# Altium schematic sheet EE52_Digital_Oscilloscope.SchDoc
size D
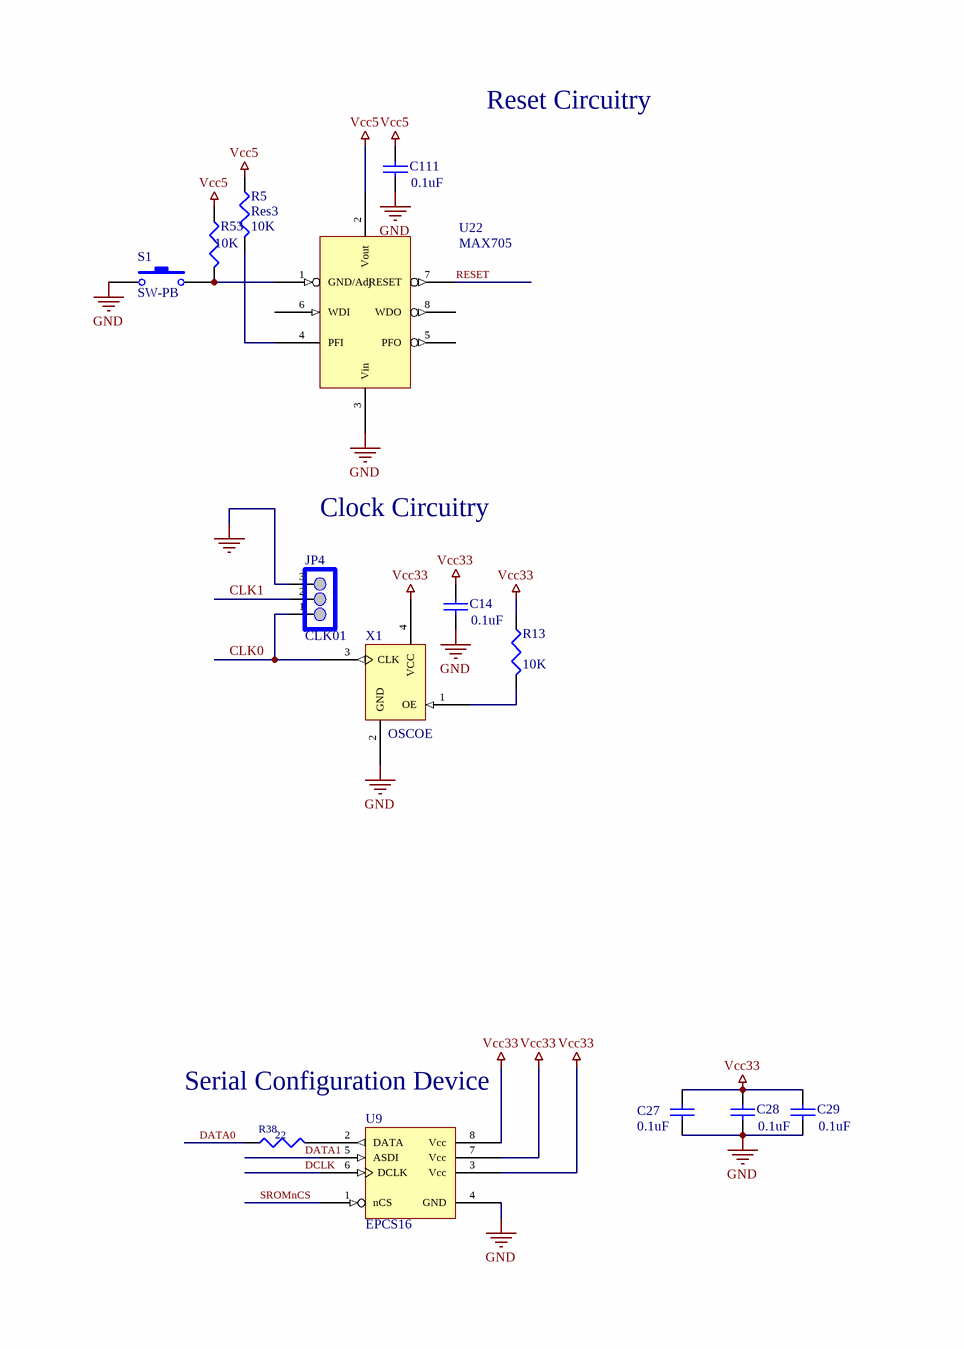
[diagram p0: EE52_Digital_Oscilloscope.SchDoc, top left]
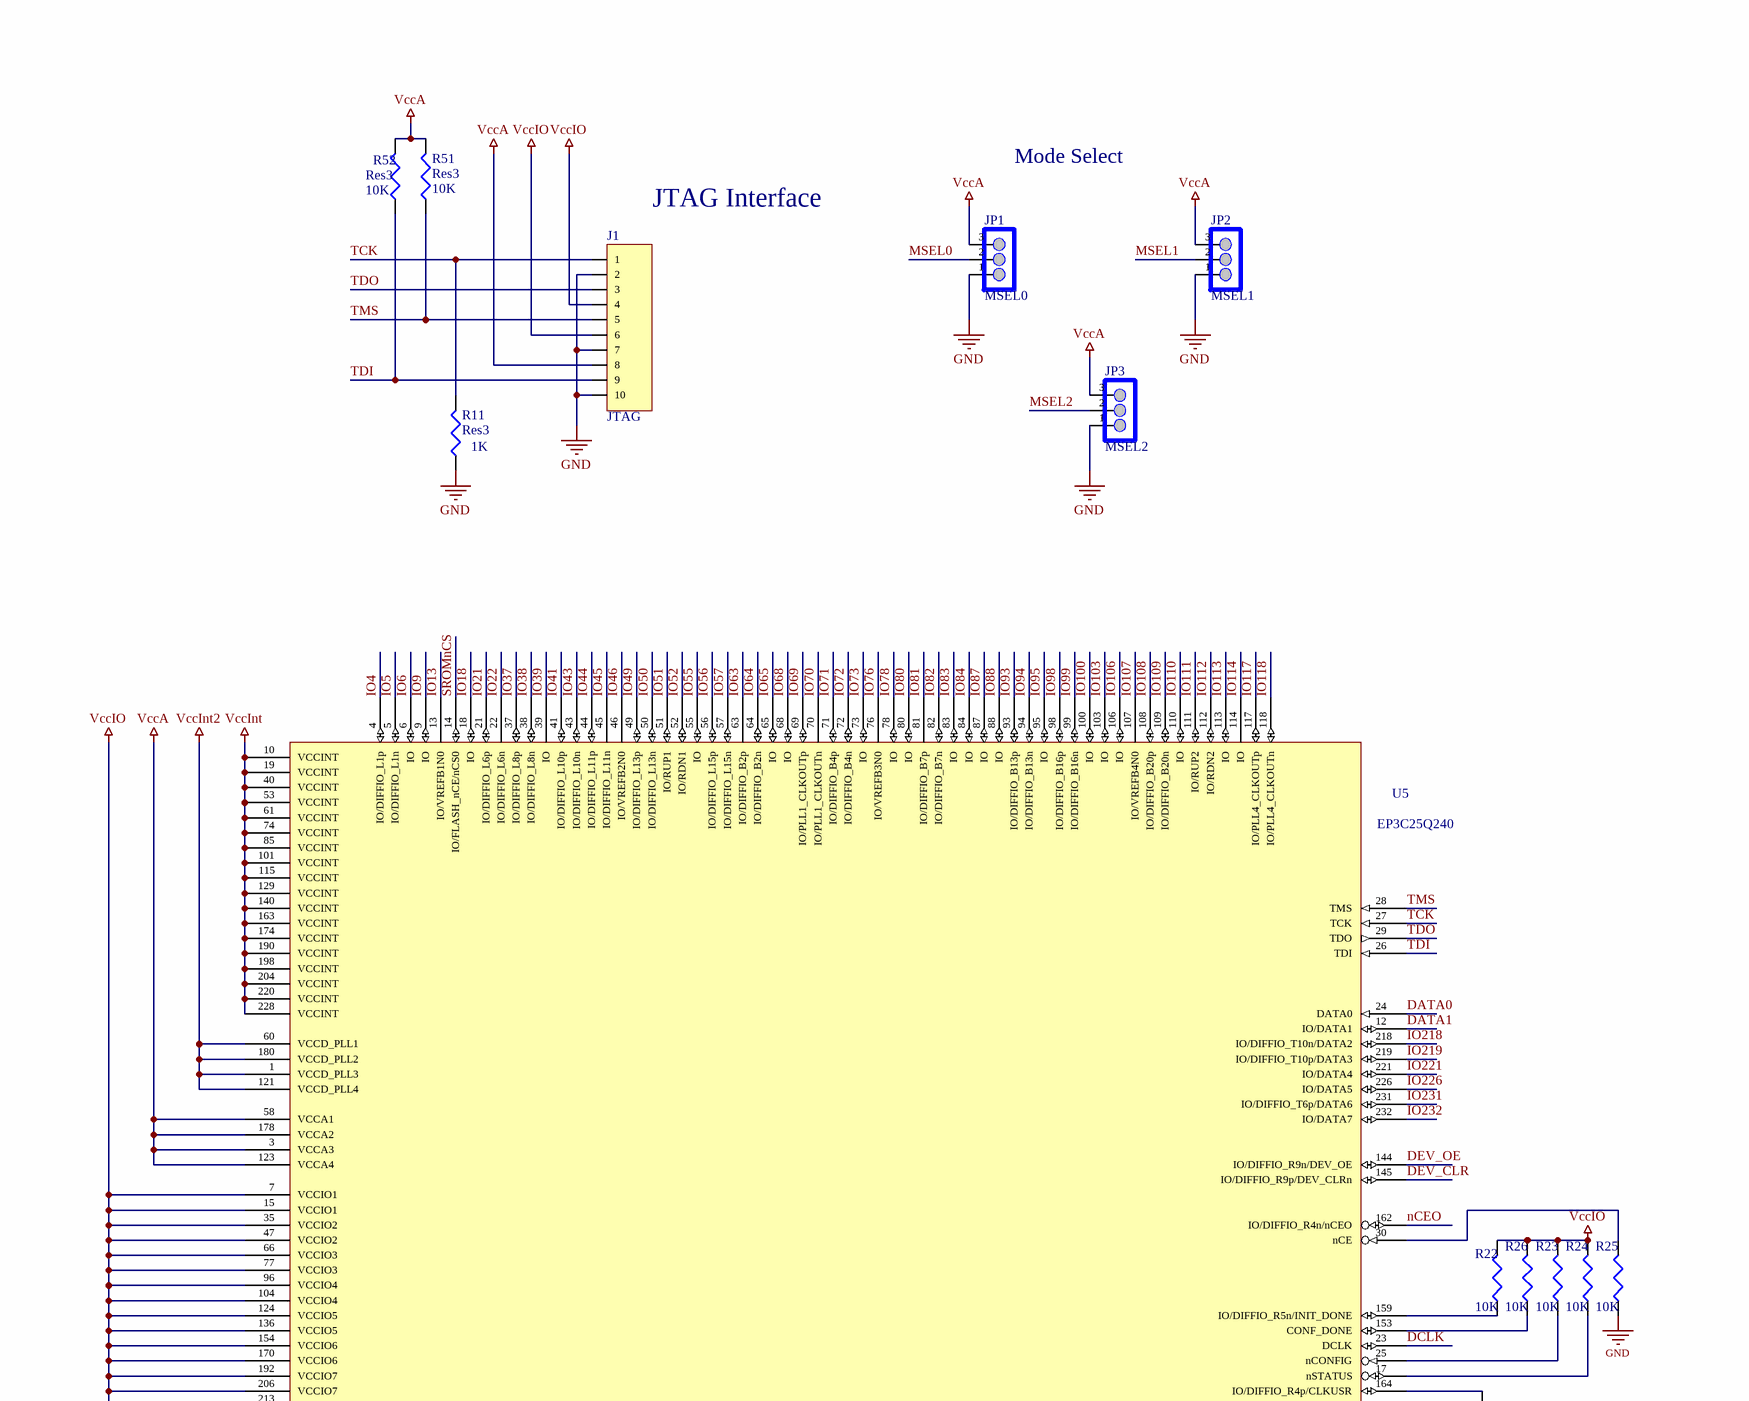
[diagram p1: EE52_Digital_Oscilloscope.SchDoc, top middle]
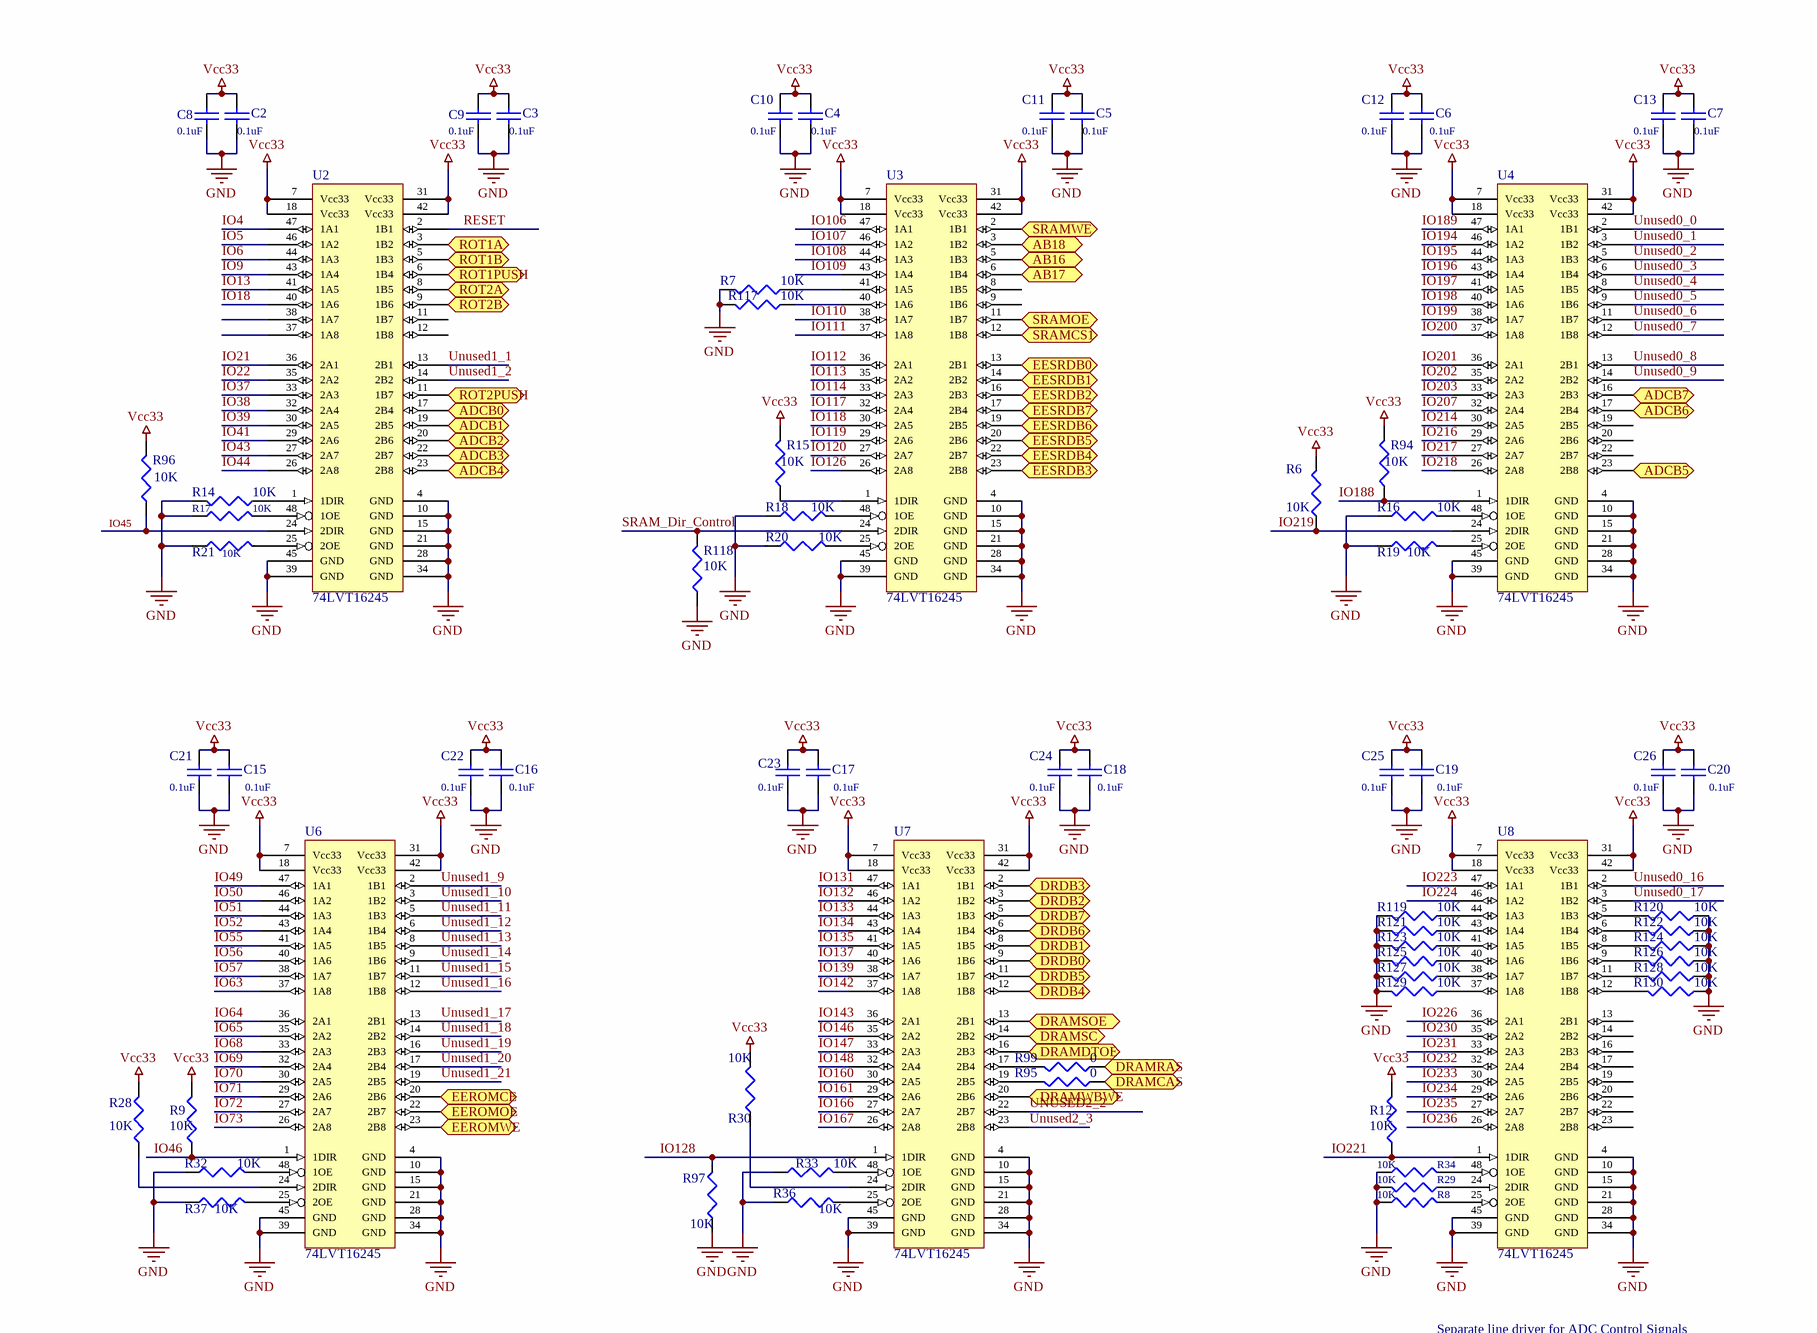
[diagram p2: EE52_Digital_Oscilloscope.SchDoc, top right]
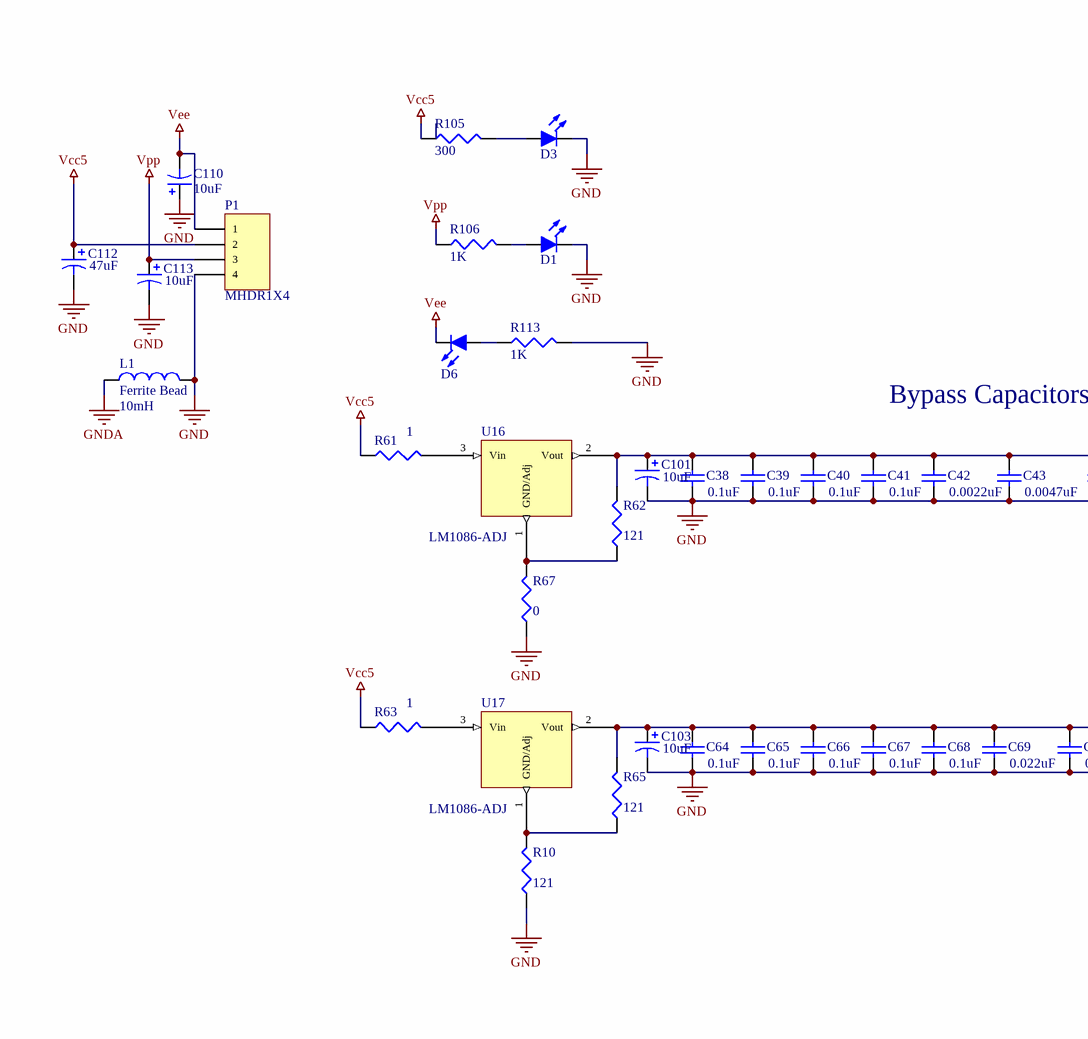
[diagram p3: EE52_Digital_Oscilloscope.SchDoc, bottom left]
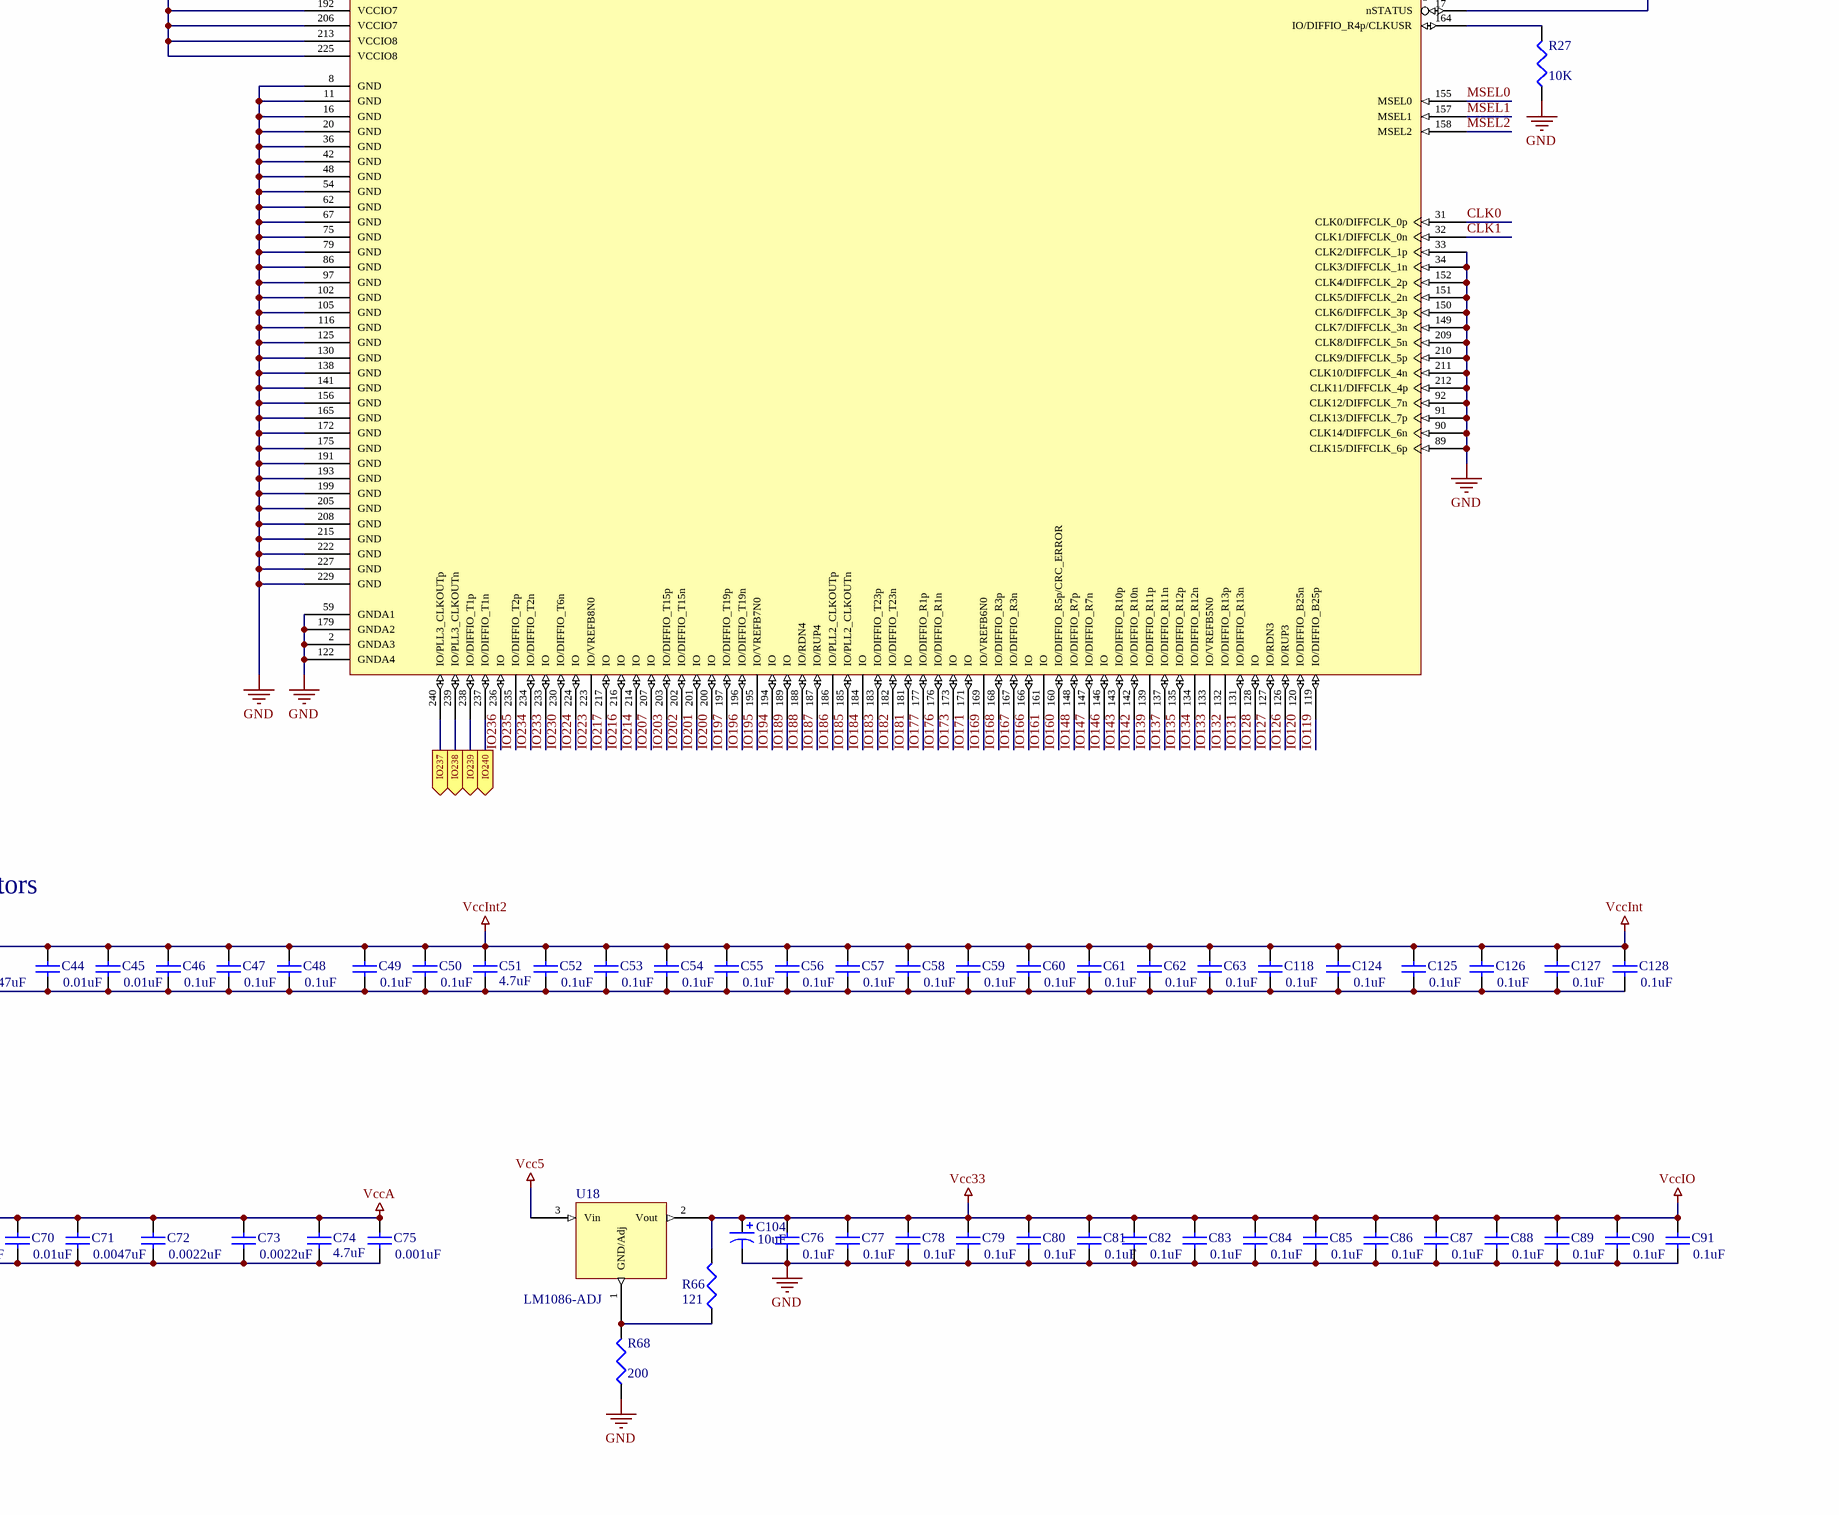
[diagram p4: EE52_Digital_Oscilloscope.SchDoc, bottom middle]
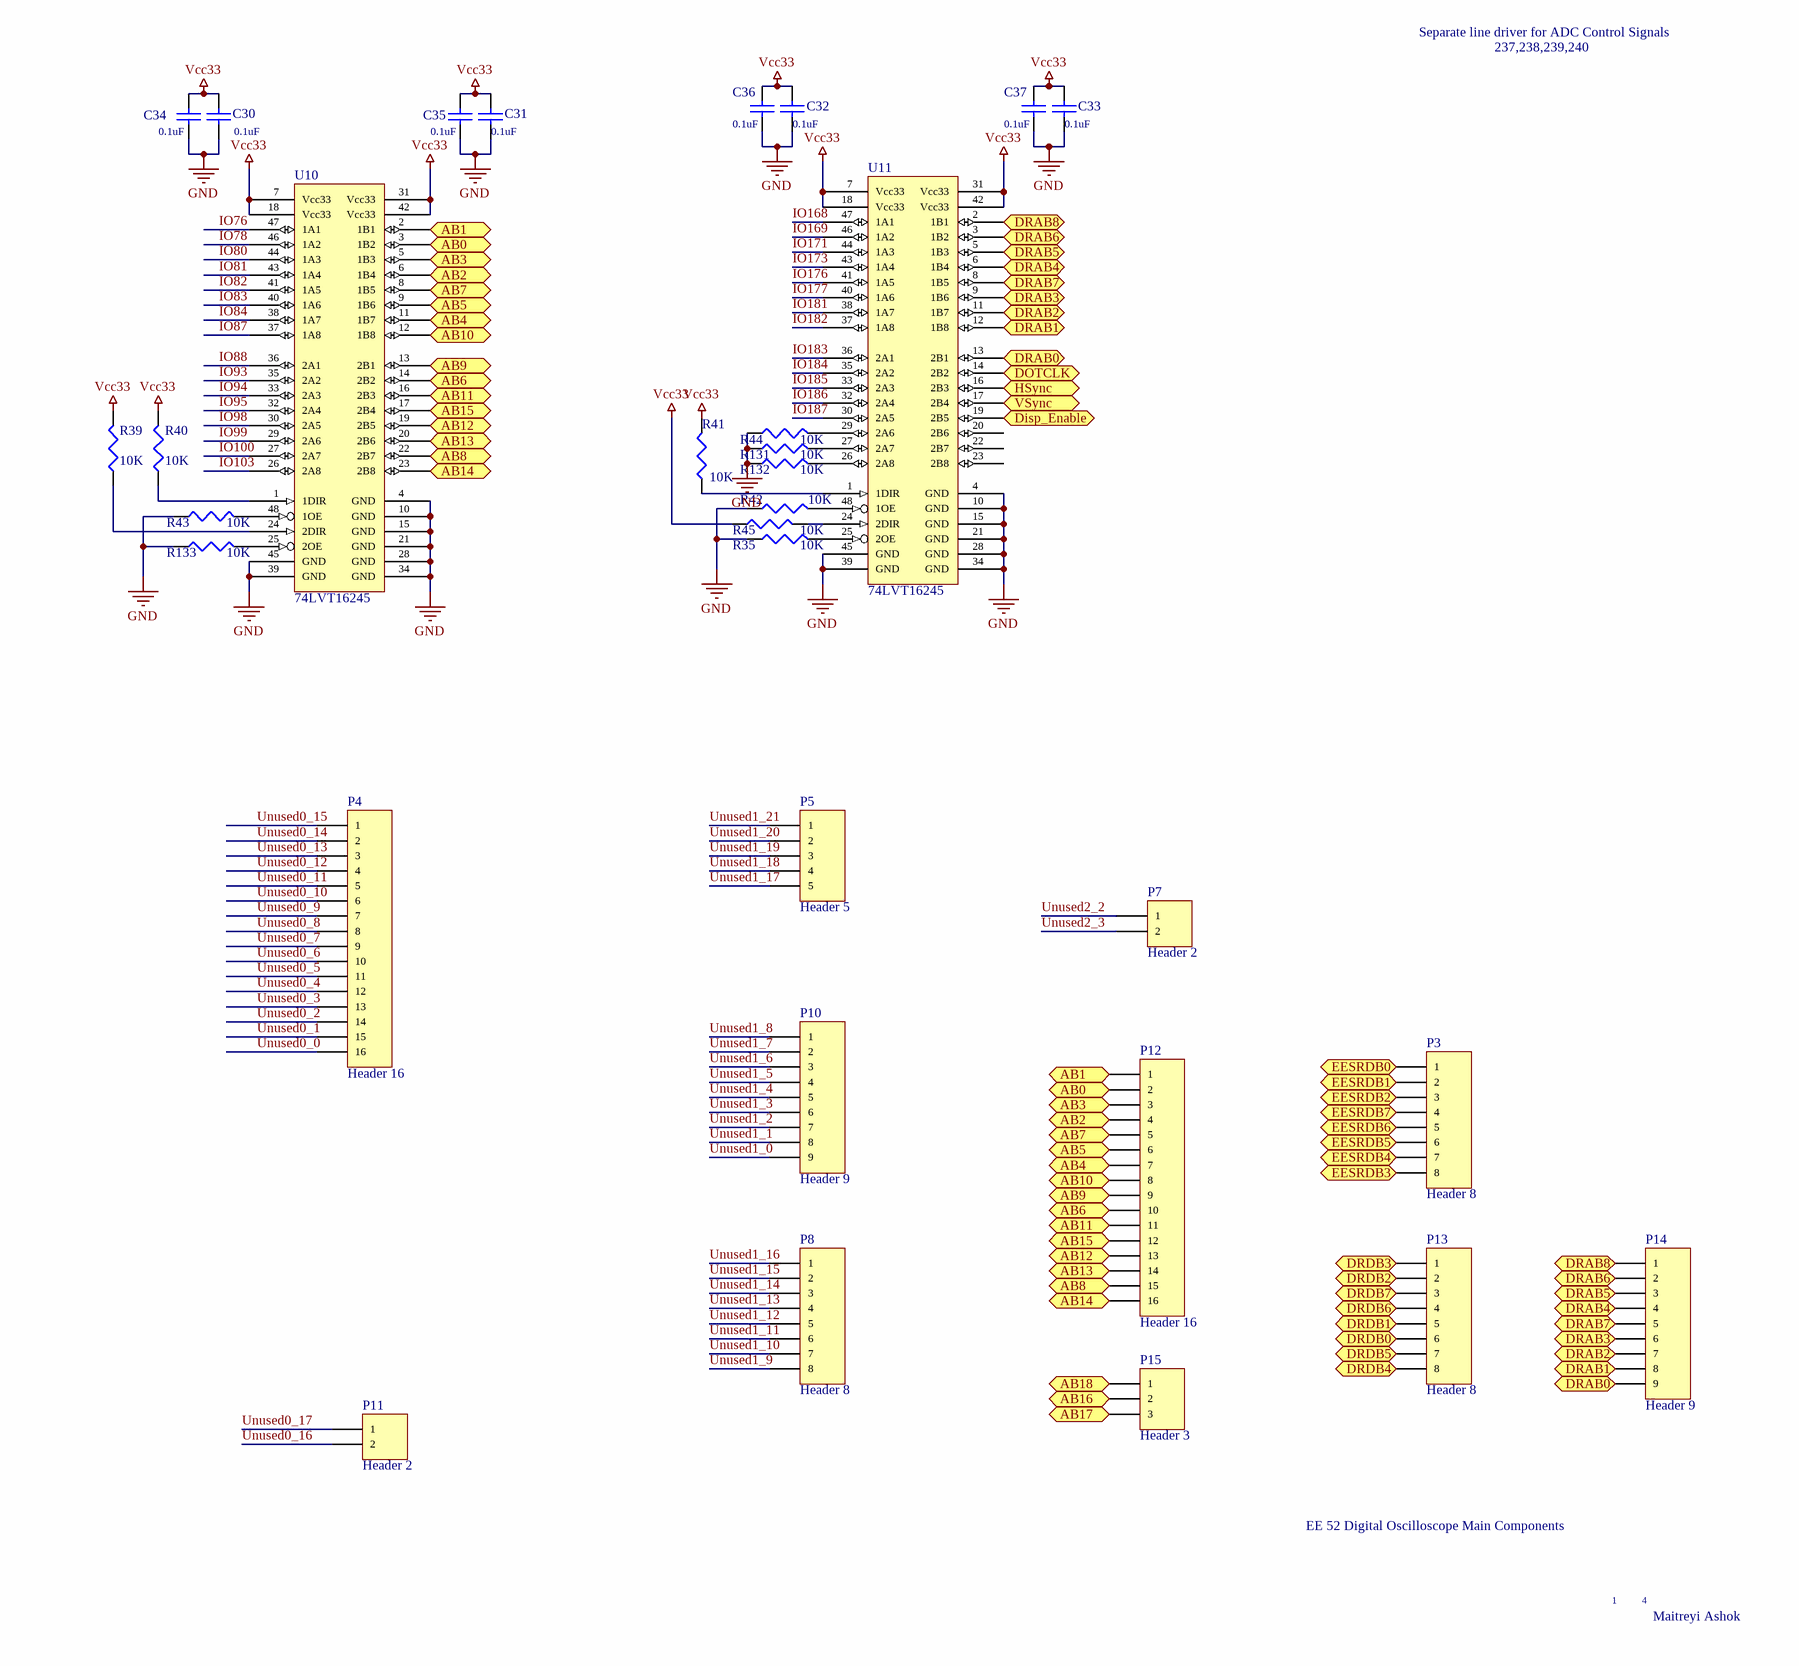
[diagram p5: EE52_Digital_Oscilloscope.SchDoc, bottom right]

## Parts
C2  value 0.1uF  [1608[0603]]  (hidden comment: Cap)
C3  value 0.1uF  [1608[0603]]  (hidden comment: Cap)
C4  value 0.1uF  [1608[0603]]  (hidden comment: Cap)
C5  value 0.1uF  [1608[0603]]  (hidden comment: Cap)
C6  value 0.1uF  [1608[0603]]  (hidden comment: Cap)
C7  value 0.1uF  [1608[0603]]  (hidden comment: Cap)
C8  value 0.1uF  [1608[0603]]  (hidden comment: Cap)
C9  value 0.1uF  [1608[0603]]  (hidden comment: Cap)
C10  value 0.1uF  [1608[0603]]  (hidden comment: Cap)
C11  value 0.1uF  [1608[0603]]  (hidden comment: Cap)
C12  value 0.1uF  [1608[0603]]  (hidden comment: Cap)
C13  value 0.1uF  [1608[0603]]  (hidden comment: Cap)
C14  value 0.1uF  [1608[0603]]  (hidden comment: Cap)
C15  value 0.1uF  [1608[0603]]  (hidden comment: Cap)
C16  value 0.1uF  [1608[0603]]  (hidden comment: Cap)
C17  value 0.1uF  [1608[0603]]  (hidden comment: Cap)
C18  value 0.1uF  [1608[0603]]  (hidden comment: Cap)
C19  value 0.1uF  [1608[0603]]  (hidden comment: Cap)
C20  value 0.1uF  [1608[0603]]  (hidden comment: Cap)
C21  value 0.1uF  [1608[0603]]  (hidden comment: Cap)
C22  value 0.1uF  [1608[0603]]  (hidden comment: Cap)
C23  value 0.1uF  [1608[0603]]  (hidden comment: Cap)
C24  value 0.1uF  [1608[0603]]  (hidden comment: Cap)
C25  value 0.1uF  [1608[0603]]  (hidden comment: Cap)
C26  value 0.1uF  [1608[0603]]  (hidden comment: Cap)
C27  value 0.1uF  [1608[0603]]  (hidden comment: Cap)
C28  value 0.1uF  [1608[0603]]  (hidden comment: Cap)
C29  value 0.1uF  [1608[0603]]  (hidden comment: Cap)
C30  value 0.1uF  [1608[0603]]  (hidden comment: Cap)
C31  value 0.1uF  [1608[0603]]  (hidden comment: Cap)
C32  value 0.1uF  [1608[0603]]  (hidden comment: Cap)
C33  value 0.1uF  [1608[0603]]  (hidden comment: Cap)
C34  value 0.1uF  [1608[0603]]  (hidden comment: Cap)
C35  value 0.1uF  [1608[0603]]  (hidden comment: Cap)
C36  value 0.1uF  [1608[0603]]  (hidden comment: Cap)
C37  value 0.1uF  [1608[0603]]  (hidden comment: Cap)
C38  value 0.1uF  [1608[0603]]  (hidden comment: Cap)
C39  value 0.1uF  [1608[0603]]  (hidden comment: Cap)
C40  value 0.1uF  [1608[0603]]  (hidden comment: Cap)
C41  value 0.1uF  [1608[0603]]  (hidden comment: Cap)
C42  value 0.0022uF  [1608[0603]]  (hidden comment: Cap)
C43  value 0.0047uF  [1608[0603]]  (hidden comment: Cap)
C44  value 0.01uF  [1608[0603]]  (hidden comment: Cap)
C45  value 0.01uF  [1608[0603]]  (hidden comment: Cap)
C46  value 0.1uF  [1608[0603]]  (hidden comment: Cap)
C47  value 0.1uF  [1608[0603]]  (hidden comment: Cap)
C48  value 0.1uF  [1608[0603]]  (hidden comment: Cap)
C49  value 0.1uF  [1608[0603]]  (hidden comment: Cap)
C50  value 0.1uF  [1608[0603]]  (hidden comment: Cap)
C51  value 4.7uF  [RB.1/.2]  (hidden comment: Cap)
C52  value 0.1uF  [1608[0603]]  (hidden comment: Cap)
C53  value 0.1uF  [1608[0603]]  (hidden comment: Cap)
C54  value 0.1uF  [1608[0603]]  (hidden comment: Cap)
C55  value 0.1uF  [1608[0603]]  (hidden comment: Cap)
C56  value 0.1uF  [1608[0603]]  (hidden comment: Cap)
C57  value 0.1uF  [1608[0603]]  (hidden comment: Cap)
C58  value 0.1uF  [1608[0603]]  (hidden comment: Cap)
C59  value 0.1uF  [1608[0603]]  (hidden comment: Cap)
C60  value 0.1uF  [1608[0603]]  (hidden comment: Cap)
C61  value 0.1uF  [1608[0603]]  (hidden comment: Cap)
C62  value 0.1uF  [1608[0603]]  (hidden comment: Cap)
C63  value 0.1uF  [1608[0603]]  (hidden comment: Cap)
C64  value 0.1uF  [1608[0603]]  (hidden comment: Cap)
C65  value 0.1uF  [1608[0603]]  (hidden comment: Cap)
C66  value 0.1uF  [1608[0603]]  (hidden comment: Cap)
C67  value 0.1uF  [1608[0603]]  (hidden comment: Cap)
C68  value 0.1uF  [1608[0603]]  (hidden comment: Cap)
C69  value 0.022uF  [1608[0603]]  (hidden comment: Cap)
C70  value 0.01uF  [1608[0603]]  (hidden comment: Cap)
C71  value 0.0047uF  [1608[0603]]  (hidden comment: Cap)
C72  value 0.0022uF  [1608[0603]]  (hidden comment: Cap)
C73  value 0.0022uF  [1608[0603]]  (hidden comment: Cap)
C74  value 4.7uF  [RB.1/.2]  (hidden comment: Cap)
C75  value 0.001uF  [1608[0603]]  (hidden comment: Cap)
C76  value 0.1uF  [1608[0603]]  (hidden comment: Cap)
C77  value 0.1uF  [1608[0603]]  (hidden comment: Cap)
C78  value 0.1uF  [1608[0603]]  (hidden comment: Cap)
C79  value 0.1uF  [1608[0603]]  (hidden comment: Cap)
C80  value 0.1uF  [1608[0603]]  (hidden comment: Cap)
C81  value 0.1uF  [1608[0603]]  (hidden comment: Cap)
C82  value 0.1uF  [1608[0603]]  (hidden comment: Cap)
C83  value 0.1uF  [1608[0603]]  (hidden comment: Cap)
C84  value 0.1uF  [1608[0603]]  (hidden comment: Cap)
C85  value 0.1uF  [1608[0603]]  (hidden comment: Cap)
C86  value 0.1uF  [1608[0603]]  (hidden comment: Cap)
C87  value 0.1uF  [1608[0603]]  (hidden comment: Cap)
C88  value 0.1uF  [1608[0603]]  (hidden comment: Cap)
C89  value 0.1uF  [1608[0603]]  (hidden comment: Cap)
C90  value 0.1uF  [1608[0603]]  (hidden comment: Cap)
C91  value 0.1uF  [1608[0603]]  (hidden comment: Cap)
C101  value 10uF  [RB.1/.2]  (hidden comment: Cap Pol1)
C103  value 10uF  [RB.1/.2]  (hidden comment: Cap Pol1)
C104  value 10uF  [RB.1/.2]  (hidden comment: Cap Pol1)
C110  value 10uF  [RB.1/.2]  (hidden comment: Cap Pol1)
C111  value 0.1uF  [1608[0603]]  (hidden comment: Cap)
C112  value 47uF  [RB.1/.2]  (hidden comment: Cap Pol1)
C113  value 10uF  [RB.1/.2]  (hidden comment: Cap Pol1)
C118  value 0.1uF  [1608[0603]]  (hidden comment: Cap)
C124  value 0.1uF  [1608[0603]]  (hidden comment: Cap)
C125  value 0.1uF  [1608[0603]]  (hidden comment: Cap)
C126  value 0.1uF  [1608[0603]]  (hidden comment: Cap)
C127  value 0.1uF  [1608[0603]]  (hidden comment: Cap)
C128  value 0.1uF  [1608[0603]]  (hidden comment: Cap)
D1  LED  [LED-T13/4]  (value not drawn)
D3  LED  [LED-T13/4]  (value not drawn)
D6  LED  [LED-T13/4]  (value not drawn)
J1  JTAG  [HDR2X5]
JP1  MSEL0  [HDR1X3]
JP2  MSEL1  [HDR1X3]
JP3  MSEL2  [HDR1X3]
JP4  CLK01  [HDR1X3]
L1  Ferrite Bead  value 10mH  [FerriteBead]
P1  MHDR1X4  [MDIN4]
P3  Header 8  [HDR1X8]
P4  Header 16  [HDR1X16]
P5  Header 5  [HDR1X5]
P7  Header 2  [HDR1X2]
P8  Header 8  [HDR1X8]
P10  Header 9  [HDR1X9]
P11  Header 2  [HDR1X2]
P12  Header 16  [HDR1X16]
P13  Header 8  [HDR1X8]
P14  Header 9  [HDR1X9]
P15  Header 3  [HDR1X3]
R5  Res3  value 10K  [J1-0603]
R6  value 10K  [J1-0603]  (hidden comment: Res3)
R7  value 10K  [J1-0603]  (hidden comment: Res3)
R8  value 10K  [J1-0603]  (hidden comment: Res3)
R9  value 10K  [J1-0603]  (hidden comment: Res3)
R10  value 121  [J1-0603]  (hidden comment: Res3)
R11  Res3  value 1K  [J1-0603]
R12  value 10K  [J1-0603]  (hidden comment: Res3)
R13  value 10K  [J1-0603]  (hidden comment: Res3)
R14  value 10K  [J1-0603]  (hidden comment: Res3)
R15  value 10K  [J1-0603]  (hidden comment: Res3)
R16  value 10K  [J1-0603]  (hidden comment: Res3)
R17  value 10K  [J1-0603]  (hidden comment: Res3)
R18  value 10K  [J1-0603]  (hidden comment: Res3)
R19  value 10K  [J1-0603]  (hidden comment: Res3)
R20  value 10K  [J1-0603]  (hidden comment: Res3)
R21  value 10K  [J1-0603]  (hidden comment: Res3)
R22  value 10K  [J1-0603]  (hidden comment: Res3)
R23  value 10K  [J1-0603]  (hidden comment: Res3)
R24  value 10K  [J1-0603]  (hidden comment: Res3)
R25  value 10K  [J1-0603]  (hidden comment: Res3)
R26  value 10K  [J1-0603]  (hidden comment: Res3)
R27  value 10K  [J1-0603]  (hidden comment: Res3)
R28  value 10K  [J1-0603]  (hidden comment: Res3)
R29  value 10K  [J1-0603]  (hidden comment: Res3)
R30  value 10K  [J1-0603]  (hidden comment: Res3)
R32  value 10K  [J1-0603]  (hidden comment: Res3)
R33  value 10K  [J1-0603]  (hidden comment: Res3)
R34  value 10K  [J1-0603]  (hidden comment: Res3)
R35  value 10K  [J1-0603]  (hidden comment: Res3)
R36  value 10K  [J1-0603]  (hidden comment: Res3)
R37  value 10K  [J1-0603]  (hidden comment: Res3)
R38  value 22  [J1-0603]  (hidden comment: Res3)
R39  value 10K  [J1-0603]  (hidden comment: Res3)
R40  value 10K  [J1-0603]  (hidden comment: Res3)
R41  value 10K  [J1-0603]  (hidden comment: Res3)
R42  value 10K  [J1-0603]  (hidden comment: Res3)
R43  value 10K  [J1-0603]  (hidden comment: Res3)
R44  value 10K  [J1-0603]  (hidden comment: Res3)
R45  value 10K  [J1-0603]  (hidden comment: Res3)
R51  Res3  value 10K  [J1-0603]
R52  Res3  value 10K  [J1-0603]
R53  value 10K  [J1-0603]  (hidden comment: Res3)
R61  value 1  [AXIAL-0.7]  (hidden comment: Res3)
R62  value 121  [J1-0603]  (hidden comment: Res3)
R63  value 1  [AXIAL-0.7]  (hidden comment: Res3)
R65  value 121  [J1-0603]  (hidden comment: Res3)
R66  value 121  [J1-0603]  (hidden comment: Res3)
R67  value 0  [J1-0603]  (hidden comment: Res3)
R68  value 200  [J1-0603]  (hidden comment: Res3)
R94  value 10K  [J1-0603]  (hidden comment: Res3)
R95  value 0  [J1-0603]  (hidden comment: Res3)
R96  value 10K  [J1-0603]  (hidden comment: Res3)
R97  value 10K  [J1-0603]  (hidden comment: Res3)
R99  value 0  [J1-0603]  (hidden comment: Res3)
R105  value 300  [J1-0603]  (hidden comment: Res3)
R106  value 1K  [J1-0603]  (hidden comment: Res3)
R113  value 1K  [J1-0603]  (hidden comment: Res3)
R117  value 10K  [J1-0603]  (hidden comment: Res3)
R118  value 10K  [J1-0603]  (hidden comment: Res3)
R119  value 10K  [J1-0603]  (hidden comment: Res3)
R120  value 10K  [J1-0603]  (hidden comment: Res3)
R121  value 10K  [J1-0603]  (hidden comment: Res3)
R122  value 10K  [J1-0603]  (hidden comment: Res3)
R123  value 10K  [J1-0603]  (hidden comment: Res3)
R124  value 10K  [J1-0603]  (hidden comment: Res3)
R125  value 10K  [J1-0603]  (hidden comment: Res3)
R126  value 10K  [J1-0603]  (hidden comment: Res3)
R127  value 10K  [J1-0603]  (hidden comment: Res3)
R128  value 10K  [J1-0603]  (hidden comment: Res3)
R129  value 10K  [J1-0603]  (hidden comment: Res3)
R130  value 10K  [J1-0603]  (hidden comment: Res3)
R131  value 10K  [J1-0603]  (hidden comment: Res3)
R132  value 10K  [J1-0603]  (hidden comment: Res3)
R133  value 10K  [J1-0603]  (hidden comment: Res3)
S1  SW-PB  [EG140X]
U2  74LVT16245  [TSSOP48]
U3  74LVT16245  [TSSOP48]
U4  74LVT16245  [TSSOP48]
U5  EP3C25Q240  [PQFP240]
U6  74LVT16245  [TSSOP48]
U7  74LVT16245  [TSSOP48]
U8  74LVT16245  [TSSOP48]
U9  EPCS16  [SO-8]
U10  74LVT16245  [TSSOP48]
U11  74LVT16245  [TSSOP48]
U16  LM1086-ADJ  [TO-220V]
U17  LM1086-ADJ  [TO-220V]
U18  LM1086-ADJ  [TO-220V]
U22  MAX705  [SO-8]
X1  OSCOE  [SG636PCE]

## Ports
AB0 (in), AB0 (out), AB1 (in), AB1 (out), AB2 (in), AB2 (out), AB3 (in), AB3 (out), AB4 (in), AB4 (out), AB5 (in), AB5 (out), AB6 (in), AB6 (out), AB7 (in), AB7 (out), AB8 (in), AB8 (out), AB9 (in), AB9 (out), AB10 (in), AB10 (out), AB11 (in), AB11 (out), AB12 (in), AB12 (out), AB13 (in), AB13 (out), AB14 (in), AB14 (out), AB15 (in), AB15 (out), AB16 (in), AB16 (out), AB17 (in), AB17 (out), AB18 (in), AB18 (out), ADCB0 (in), ADCB1 (in), ADCB2 (in), ADCB3 (in), ADCB4 (in), ADCB5 (in), ADCB6 (in), ADCB7 (in), Disp_Enable (out), DOTCLK (out), DRAB0 (in), DRAB0 (out), DRAB1 (in), DRAB1 (out), DRAB2 (in), DRAB2 (out), DRAB3 (in), DRAB3 (out), DRAB4 (in), DRAB4 (out), DRAB5 (in), DRAB5 (out), DRAB6 (in), DRAB6 (out), DRAB7 (in), DRAB7 (out), DRAB8 (in), DRAB8 (out), DRAMCAS (out), DRAMDTOE (out), DRAMRAS (out), DRAMSC (out), DRAMSOE (out), DRAMWBWE (out), DRDB0 (bidir), DRDB1 (bidir), DRDB2 (bidir), DRDB3 (bidir), DRDB4 (bidir), DRDB5 (bidir), DRDB6 (bidir), DRDB7 (bidir), EEROMCE (out), EEROMOE (out), EEROMWE (out), EESRDB0 (bidir), EESRDB1 (bidir), EESRDB2 (bidir), EESRDB3 (bidir), EESRDB4 (bidir), EESRDB5 (bidir), EESRDB6 (bidir), EESRDB7 (bidir), HSync (out), IO237 (out), IO238 (out), IO239 (out), IO240 (out), ROT1A (in), ROT1B (in), ROT1PUSH (in), ROT2A (in), ROT2B (in), ROT2PUSH (in), SRAMCS1 (out), SRAMOE (out), SRAMWE (out), VSync (out)

## Nets
GND: C2.1 C3.1 C4.1 C5.1 C6.1 C7.1 C8.1 C9.1 C10.1 C11.1 C12.1 C13.1 C14.1 C15.1 C16.1 C17.1 C18.1 C19.1 C20.1 C21.1 C22.1 C23.1 C24.1 C25.1 C26.1 C27.1 C28.1 C29.1 C30.1 C31.1 C32.1 C33.1 C34.1 C35.1 C36.1 C37.1 C38.1 C39.1 C40.1 C41.1 C42.1 C43.1 C44.1 C45.1 C46.1 C47.1 C48.1 C49.1 C50.1 C51.2 C52.1 C53.1 C54.1 C55.1 C56.1 C57.1 C58.1 C59.1 C60.1 C61.1 C62.1 C63.1 C64.1 C65.1 C66.1 C67.1 C68.1 C69.1 C70.1 C71.1 C72.1 C73.1 C74.2 C75.1 C76.1 C77.1 C78.1 C79.1 C80.1 C81.1 C82.1 C83.1 C84.1 C85.1 C86.1 C87.1 C88.1 C89.1 C90.1 C91.1 C101.2 C103.2 C104.2 C110.1 C111.1 C112.2 C113.2 C118.1 C124.1 C125.1 C126.1 C127.1 C128.1 D1.2(K) D3.2(K) J1.2 J1.7 J1.10 JP1.1(J1) JP2.1(J1) JP3.1(J1) JP4.3(J3) L1.2 P1.4 R7.2 R8.1 R10.1 R11.1 R14.2 R16.1 R17.1 R18.1 R19.1 R20.1 R21.1 R25.1 R27.1 R29.2 R32.1 R33.1 R34.1 R35.1 R36.1 R37.1 R42.1 R43.1 R44.1 R67.1 R68.1 R97.1 R113.2 R117.2 R118.1 R119.2 R120.1 R121.2 R122.1 R123.2 R124.1 R125.2 R126.1 R127.2 R128.1 R129.2 R130.1 R131.1 R132.1 R133.1 S1.1 U2.4(GND) U2.10(GND) U2.15(GND) U2.21(GND) U2.28(GND) U2.34(GND) U2.39(GND) U2.45(GND) U3.4(GND) U3.10(GND) U3.15(GND) U3.21(GND) U3.28(GND) U3.34(GND) U3.39(GND) U3.45(GND) U4.4(GND) U4.10(GND) U4.15(GND) U4.21(GND) U4.28(GND) U4.34(GND) U4.39(GND) U4.45(GND) U5.2(GNDA3) U5.8(GND) U5.11(GND) U5.16(GND) U5.20(GND) U5.33(CLK2/DIFFCLK_1p) U5.34(CLK3/DIFFCLK_1n) U5.36(GND) U5.42(GND) U5.48(GND) U5.54(GND) U5.59(GNDA1) U5.62(GND) U5.67(GND) U5.75(GND) U5.79(GND) U5.86(GND) U5.89(CLK15/DIFFCLK_6p) U5.90(CLK14/DIFFCLK_6n) U5.91(CLK13/DIFFCLK_7p) U5.92(CLK12/DIFFCLK_7n) U5.97(GND) U5.102(GND) U5.105(GND) U5.116(GND) U5.122(GNDA4) U5.125(GND) U5.130(GND) U5.138(GND) U5.141(GND) U5.149(CLK7/DIFFCLK_3n) U5.150(CLK6/DIFFCLK_3p) U5.151(CLK5/DIFFCLK_2n) U5.152(CLK4/DIFFCLK_2p) U5.156(GND) U5.165(GND) U5.172(GND) U5.175(GND) U5.179(GNDA2) U5.191(GND) U5.193(GND) U5.199(GND) U5.205(GND) U5.208(GND) U5.209(CLK8/DIFFCLK_5n) U5.210(CLK9/DIFFCLK_5p) U5.211(CLK10/DIFFCLK_4n) U5.212(CLK11/DIFFCLK_4p) U5.215(GND) U5.222(GND) U5.227(GND) U5.229(GND) U6.4(GND) U6.10(GND) U6.15(GND) U6.21(GND) U6.28(GND) U6.34(GND) U6.39(GND) U6.45(GND) U7.4(GND) U7.10(GND) U7.15(GND) U7.21(GND) U7.28(GND) U7.34(GND) U7.39(GND) U7.45(GND) U8.4(GND) U8.10(GND) U8.15(GND) U8.21(GND) U8.28(GND) U8.34(GND) U8.39(GND) U8.45(GND) U9.4(GND) U10.4(GND) U10.10(GND) U10.15(GND) U10.21(GND) U10.28(GND) U10.34(GND) U10.39(GND) U10.45(GND) U11.4(GND) U11.10(GND) U11.15(GND) U11.21(GND) U11.28(GND) U11.34(GND) U11.39(GND) U11.45(GND) U22.3(Vin) X1.2(GND)
GNDA: L1.1
VCC: C2.2 C3.2 C4.2 C5.2 C6.2 C7.2 C8.2 C9.2 C10.2 C11.2 C12.2 C13.2 C14.2 C15.2 C16.2 C17.2 C18.2 C19.2 C20.2 C21.2 C22.2 C23.2 C24.2 C25.2 C26.2 C27.2 C28.2 C29.2 C30.2 C31.2 C32.2 C33.2 C34.2 C35.2 C36.2 C37.2 C76.2 C77.2 C78.2 C79.2 C80.2 C81.2 C82.2 C83.2 C84.2 C85.2 C86.2 C87.2 C88.2 C89.2 C90.2 C91.2 C104.1 J1.4 J1.6 R6.2 R9.2 R12.2 R13.1 R15.2 R22.2 R23.2 R24.2 R26.2 R28.2 R30.2 R39.2 R40.2 R41.2 R45.1 R66.2 R94.2 R96.2 U2.7(Vcc33) U2.18(Vcc33) U2.31(Vcc33) U2.42(Vcc33) U3.7(Vcc33) U3.18(Vcc33) U3.31(Vcc33) U3.42(Vcc33) U4.7(Vcc33) U4.18(Vcc33) U4.31(Vcc33) U4.42(Vcc33) U5.7(VCCIO1) U5.15(VCCIO1) U5.35(VCCIO2) U5.47(VCCIO2) U5.66(VCCIO3) U5.77(VCCIO3) U5.96(VCCIO4) U5.104(VCCIO4) U5.124(VCCIO5) U5.136(VCCIO5) U5.154(VCCIO6) U5.170(VCCIO6) U5.192(VCCIO7) U5.206(VCCIO7) U5.213(VCCIO8) U5.225(VCCIO8) U6.7(Vcc33) U6.18(Vcc33) U6.31(Vcc33) U6.42(Vcc33) U7.7(Vcc33) U7.18(Vcc33) U7.31(Vcc33) U7.42(Vcc33) U8.7(Vcc33) U8.18(Vcc33) U8.31(Vcc33) U8.42(Vcc33) U9.3(Vcc) U9.7(Vcc) U9.8(Vcc) U10.7(Vcc33) U10.18(Vcc33) U10.31(Vcc33) U10.42(Vcc33) U11.7(Vcc33) U11.18(Vcc33) U11.31(Vcc33) U11.42(Vcc33) U18.2(Vout) X1.4(VCC)  [also labelled Vcc33, VccIO]
Vcc5: C111.2 C112.1 P1.2 R5.1 R53.1 R61.1 R63.1 R105.1 U18.3(Vin) U22.2(Vout)
VccA: C64.2 C65.2 C66.2 C67.2 C68.2 C69.2 C70.2 C71.2 C72.2 C73.2 C74.1 C75.2 C103.1 J1.8 JP1.3(J3) JP2.3(J3) JP3.3(J3) R51.2 R52.2(BOT) R65.2 U5.3(VCCA3) U5.58(VCCA1) U5.123(VCCA4) U5.178(VCCA2) U17.2(Vout)
VccInt: C38.2 C39.2 C40.2 C41.2 C42.2 C43.2 C44.2 C45.2 C46.2 C47.2 C48.2 C49.2 C50.2 C51.1 C52.2 C53.2 C54.2 C55.2 C56.2 C57.2 C58.2 C59.2 C60.2 C61.2 C62.2 C63.2 C101.1 C118.2 C124.2 C125.2 C126.2 C127.2 C128.2 R62.2 U5.1(VCCD_PLL3) U5.10(VCCINT) U5.19(VCCINT) U5.40(VCCINT) U5.53(VCCINT) U5.60(VCCD_PLL1) U5.61(VCCINT) U5.74(VCCINT) U5.85(VCCINT) U5.101(VCCINT) U5.115(VCCINT) U5.121(VCCD_PLL4) U5.129(VCCINT) U5.140(VCCINT) U5.163(VCCINT) U5.174(VCCINT) U5.180(VCCD_PLL2) U5.190(VCCINT) U5.198(VCCINT) U5.204(VCCINT) U5.220(VCCINT) U5.228(VCCINT) U16.2(Vout)  [also labelled VccInt2]
Vee: C110.2 D6.2(K) P1.1
Vpp: C113.1 P1.3 R106.1
AB0: P12.2 U10.3(1B2) ; port AB0
AB1: P12.1 U10.2(1B1) ; port AB1
AB2: P12.4 U10.6(1B4) ; port AB2
AB3: P12.3 U10.5(1B3) ; port AB3
AB4: P12.7 U10.11(1B7) ; port AB4
AB5: P12.6 U10.9(1B6) ; port AB5
AB6: P12.10 U10.14(2B2) ; port AB6
AB7: P12.5 U10.8(1B5) ; port AB7
AB8: P12.15 U10.22(2B7) ; port AB8
AB9: P12.9 U10.13(2B1) ; port AB9
AB10: P12.8 U10.12(1B8) ; port AB10
AB11: P12.11 U10.16(2B3) ; port AB11
AB12: P12.13 U10.19(2B5) ; port AB12
AB13: P12.14 U10.20(2B6) ; port AB13
AB14: P12.16 U10.23(2B8) ; port AB14
AB15: P12.12 U10.17(2B4) ; port AB15
AB16: P15.2 U3.5(1B3) ; port AB16
AB17: P15.3 U3.6(1B4) ; port AB17
AB18: P15.1 U3.3(1B2) ; port AB18
ADCB0: U2.17(2B4) ; port ADCB0
ADCB1: U2.19(2B5) ; port ADCB1
ADCB2: U2.20(2B6) ; port ADCB2
ADCB3: U2.22(2B7) ; port ADCB3
ADCB4: U2.23(2B8) ; port ADCB4
ADCB5: U4.23(2B8) ; port ADCB5
ADCB6: U4.17(2B4) ; port ADCB6
ADCB7: U4.16(2B3) ; port ADCB7
CLK0: JP4.1(J1) U5.31(CLK0/DIFFCLK_0p) X1.3(CLK)
CLK1: JP4.2(J2) U5.32(CLK1/DIFFCLK_0n)
DATA0: R38.1 U5.24(DATA0)
DATA1: U5.12(IO/DATA1) U9.5(ASDI)
DCLK: U5.23(DCLK) U9.6(DCLK)
DEV_CLR: U5.145(IO/DIFFIO_R9p/DEV_CLRn)
DEV_OE: U5.144(IO/DIFFIO_R9n/DEV_OE)
Disp_Enable: U11.19(2B5) ; port Disp_Enable
DOTCLK: U11.14(2B2) ; port DOTCLK
DRAB0: P14.9 U11.13(2B1) ; port DRAB0
DRAB1: P14.8 U11.12(1B8) ; port DRAB1
DRAB2: P14.7 U11.11(1B7) ; port DRAB2
DRAB3: P14.6 U11.9(1B6) ; port DRAB3
DRAB4: P14.4 U11.6(1B4) ; port DRAB4
DRAB5: P14.3 U11.5(1B3) ; port DRAB5
DRAB6: P14.2 U11.3(1B2) ; port DRAB6
DRAB7: P14.5 U11.8(1B5) ; port DRAB7
DRAB8: P14.1 U11.2(1B1) ; port DRAB8
DRAMCAS: R95.1 ; port DRAMCAS
DRAMDTOE: U7.16(2B3) ; port DRAMDTOE
DRAMRAS: R99.1 ; port DRAMRAS
DRAMSC: U7.14(2B2) ; port DRAMSC
DRAMSOE: U7.13(2B1) ; port DRAMSOE
DRAMWBWE: U7.20(2B6) ; port DRAMWBWE
DRDB0: P13.6 U7.9(1B6) ; port DRDB0
DRDB1: P13.5 U7.8(1B5) ; port DRDB1
DRDB2: P13.2 U7.3(1B2) ; port DRDB2
DRDB3: P13.1 U7.2(1B1) ; port DRDB3
DRDB4: P13.8 U7.12(1B8) ; port DRDB4
DRDB5: P13.7 U7.11(1B7) ; port DRDB5
DRDB6: P13.4 U7.6(1B4) ; port DRDB6
DRDB7: P13.3 U7.5(1B3) ; port DRDB7
EEROMCE: U6.20(2B6) ; port EEROMCE
EEROMOE: U6.22(2B7) ; port EEROMOE
EEROMWE: U6.23(2B8) ; port EEROMWE
EESRDB0: P3.1 U3.13(2B1) ; port EESRDB0
EESRDB1: P3.2 U3.14(2B2) ; port EESRDB1
EESRDB2: P3.3 U3.16(2B3) ; port EESRDB2
EESRDB3: P3.8 U3.23(2B8) ; port EESRDB3
EESRDB4: P3.7 U3.22(2B7) ; port EESRDB4
EESRDB5: P3.6 U3.20(2B6) ; port EESRDB5
EESRDB6: P3.5 U3.19(2B5) ; port EESRDB6
EESRDB7: P3.4 U3.17(2B4) ; port EESRDB7
HSync: U11.16(2B3) ; port HSync
IO4: U2.47(1A1) U5.4(IO/DIFFIO_L1p)
IO5: U2.46(1A2) U5.5(IO/DIFFIO_L1n)
IO6: U2.44(1A3) U5.6(IO)
IO9: U2.43(1A4) U5.9(IO)
IO13: U2.41(1A5) U5.13(IO/VREFB1N0)
IO18: U2.40(1A6) U5.18(IO)
IO21: U2.36(2A1) U5.21(IO/DIFFIO_L6p)
IO22: U2.35(2A2) U5.22(IO/DIFFIO_L6n)
IO37: U2.33(2A3) U5.37(IO/DIFFIO_L8p)
IO38: U2.32(2A4) U5.38(IO/DIFFIO_L8n)
IO39: U2.30(2A5) U5.39(IO)
IO41: U2.29(2A6) U5.41(IO/DIFFIO_L10p)
IO43: U2.27(2A7) U5.43(IO/DIFFIO_L10n)
IO44: U2.26(2A8) U5.44(IO/DIFFIO_L11p)
IO45: R96.1 U2.24(2DIR) U5.45(IO/DIFFIO_L11n)
IO46: R9.1 U5.46(IO/VREFB2N0) U6.1(1DIR)
IO49: U5.49(IO/DIFFIO_L13p) U6.47(1A1)
IO50: U5.50(IO/DIFFIO_L13n) U6.46(1A2)
IO51: U5.51(IO/RUP1) U6.44(1A3)
IO52: U5.52(IO/RDN1) U6.43(1A4)
IO55: U5.55(IO) U6.41(1A5)
IO56: U5.56(IO/DIFFIO_L15p) U6.40(1A6)
IO57: U5.57(IO/DIFFIO_L15n) U6.38(1A7)
IO63: U5.63(IO/DIFFIO_B2p) U6.37(1A8)
IO64: U5.64(IO/DIFFIO_B2n) U6.36(2A1)
IO65: U5.65(IO) U6.35(2A2)
IO68: U5.68(IO) U6.33(2A3)
IO69: U5.69(IO/PLL1_CLKOUTp) U6.32(2A4)
IO70: U5.70(IO/PLL1_CLKOUTn) U6.30(2A5)
IO71: U5.71(IO/DIFFIO_B4p) U6.29(2A6)
IO72: U5.72(IO/DIFFIO_B4n) U6.27(2A7)
IO73: U5.73(IO) U6.26(2A8)
IO76: U5.76(IO/VREFB3N0) U10.47(1A1)
IO78: U5.78(IO) U10.46(1A2)
IO80: U5.80(IO) U10.44(1A3)
IO81: U5.81(IO/DIFFIO_B7p) U10.43(1A4)
IO82: U5.82(IO/DIFFIO_B7n) U10.41(1A5)
IO83: U5.83(IO) U10.40(1A6)
IO84: U5.84(IO) U10.38(1A7)
IO87: U5.87(IO) U10.37(1A8)
IO88: U5.88(IO) U10.36(2A1)
IO93: U5.93(IO/DIFFIO_B13p) U10.35(2A2)
IO94: U5.94(IO/DIFFIO_B13n) U10.33(2A3)
IO95: U5.95(IO) U10.32(2A4)
IO98: U5.98(IO/DIFFIO_B16p) U10.30(2A5)
IO99: U5.99(IO/DIFFIO_B16n) U10.29(2A6)
IO100: U5.100(IO) U10.27(2A7)
IO103: U5.103(IO) U10.26(2A8)
IO106: U3.47(1A1) U5.106(IO)
IO107: U3.46(1A2) U5.107(IO/VREFB4N0)
IO108: U3.44(1A3) U5.108(IO/DIFFIO_B20p)
IO109: U3.43(1A4) U5.109(IO/DIFFIO_B20n)
IO110: U3.38(1A7) U5.110(IO)
IO111: U3.37(1A8) U5.111(IO/RUP2)
IO112: U3.36(2A1) U5.112(IO/RDN2)
IO113: U3.35(2A2) U5.113(IO)
IO114: U3.33(2A3) U5.114(IO)
IO117: U3.32(2A4) U5.117(IO/PLL4_CLKOUTp)
IO118: U3.30(2A5) U5.118(IO/PLL4_CLKOUTn)
IO119: U3.29(2A6) U5.119(IO/DIFFIO_B25p)
IO120: U3.27(2A7) U5.120(IO/DIFFIO_B25n)
IO126: U3.26(2A8) U5.126(IO/RUP3)
IO127: U5.127(IO/RDN3)
IO128: R97.2 U5.128(IO) U7.1(1DIR)
IO131: U5.131(IO/DIFFIO_R13n) U7.47(1A1)
IO132: U5.132(IO/DIFFIO_R13p) U7.46(1A2)
IO133: U5.133(IO/VREFB5N0) U7.44(1A3)
IO134: U5.134(IO/DIFFIO_R12n) U7.43(1A4)
IO135: U5.135(IO/DIFFIO_R12p) U7.41(1A5)
IO137: U5.137(IO/DIFFIO_R11n) U7.40(1A6)
IO139: U5.139(IO/DIFFIO_R11p) U7.38(1A7)
IO142: U5.142(IO/DIFFIO_R10n) U7.37(1A8)
IO143: U5.143(IO/DIFFIO_R10p) U7.36(2A1)
IO146: U5.146(IO) U7.35(2A2)
IO147: U5.147(IO/DIFFIO_R7n) U7.33(2A3)
IO148: U5.148(IO/DIFFIO_R7p) U7.32(2A4)
IO160: U5.160(IO/DIFFIO_R5p/CRC_ERROR) U7.30(2A5)
IO161: U5.161(IO) U7.29(2A6)
IO166: U5.166(IO) U7.27(2A7)
IO167: U5.167(IO/DIFFIO_R3n) U7.26(2A8)
IO168: U5.168(IO/DIFFIO_R3p) U11.47(1A1)
IO169: U5.169(IO/VREFB6N0) U11.46(1A2)
IO171: U5.171(IO) U11.44(1A3)
IO173: U5.173(IO) U11.43(1A4)
IO176: U5.176(IO/DIFFIO_R1n) U11.41(1A5)
IO177: U5.177(IO/DIFFIO_R1p) U11.40(1A6)
IO181: U5.181(IO) U11.38(1A7)
IO182: U5.182(IO/DIFFIO_T23n) U11.37(1A8)
IO183: U5.183(IO/DIFFIO_T23p) U11.36(2A1)
IO184: U5.184(IO) U11.35(2A2)
IO185: U5.185(IO/PLL2_CLKOUTn) U11.33(2A3)
IO186: U5.186(IO/PLL2_CLKOUTp) U11.32(2A4)
IO187: U5.187(IO/RUP4) U11.30(2A5)
IO188: R94.1 U4.1(1DIR) U5.188(IO/RDN4)
IO189: U4.47(1A1) U5.189(IO)
IO194: U4.46(1A2) U5.194(IO)
IO195: U4.44(1A3) U5.195(IO/VREFB7N0)
IO196: U4.43(1A4) U5.196(IO/DIFFIO_T19n)
IO197: U4.41(1A5) U5.197(IO/DIFFIO_T19p)
IO198: U4.40(1A6)
IO199: U4.38(1A7)
IO200: U4.37(1A8) U5.200(IO)
IO201: U4.36(2A1) U5.201(IO)
IO202: U4.35(2A2) U5.202(IO/DIFFIO_T15n)
IO203: U4.33(2A3) U5.203(IO/DIFFIO_T15p)
IO207: U4.32(2A4) U5.207(IO)
IO214: U4.30(2A5) U5.214(IO)
IO216: U4.29(2A6) U5.216(IO)
IO217: U4.27(2A7) U5.217(IO)
IO218: U4.26(2A8) U5.218(IO/DIFFIO_T10n/DATA2)
IO219: R6.1 U4.24(2DIR) U5.219(IO/DIFFIO_T10p/DATA3)
IO221: R12.1 U5.221(IO/DATA4) U8.1(1DIR)
IO223: U5.223(IO/VREFB8N0) U8.47(1A1)
IO224: U5.224(IO) U8.46(1A2)
IO226: U5.226(IO/DATA5) U8.36(2A1)
IO230: U5.230(IO/DIFFIO_T6n) U8.35(2A2)
IO231: U5.231(IO/DIFFIO_T6p/DATA6) U8.33(2A3)
IO232: U5.232(IO/DATA7) U8.32(2A4)
IO233: U5.233(IO) U8.30(2A5)
IO234: U5.234(IO/DIFFIO_T2n) U8.29(2A6)
IO235: U5.235(IO/DIFFIO_T2p) U8.27(2A7)
IO236: U5.236(IO) U8.26(2A8)
IO237: U5.240(IO/PLL3_CLKOUTp) ; port IO237
IO238: U5.239(IO/PLL3_CLKOUTn) ; port IO238
IO239: U5.238(IO/DIFFIO_T1p) ; port IO239
IO240: U5.237(IO/DIFFIO_T1n) ; port IO240
MSEL0: JP1.2(J2) U5.155(MSEL0)
MSEL1: JP2.2(J2) U5.157(MSEL1)
MSEL2: JP3.2(J2) U5.158(MSEL2)
nCEO: U5.162(IO/DIFFIO_R4n/nCEO)
RESET: U2.2(1B1) U22.7(RESET)
ROT1A: U2.3(1B2) ; port ROT1A
ROT1B: U2.5(1B3) ; port ROT1B
ROT1PUSH: U2.6(1B4) ; port ROT1PUSH
ROT2A: U2.8(1B5) ; port ROT2A
ROT2B: U2.9(1B6) ; port ROT2B
ROT2PUSH: U2.11(1B7) ; port ROT2PUSH
SRAM_Dir_Control: R118.2 U3.24(2DIR)
SRAMCS1: U3.12(1B8) ; port SRAMCS1
SRAMOE: U3.11(1B7) ; port SRAMOE
SRAMWE: U3.2(1B1) ; port SRAMWE
SROMnCS: U5.14(IO/FLASH_nCE/nCS0) U9.1(nCS)
TCK: J1.1 R11.2 U5.27(TCK)
TDI: J1.9 R52.1(TOP) U5.26(TDI)
TDO: J1.3 U5.29(TDO)
TMS: J1.5 R51.1 U5.28(TMS)
Unused0_0: P4.16 U4.2(1B1)
Unused0_1: P4.15 U4.3(1B2)
Unused0_2: P4.14 U4.5(1B3)
Unused0_3: P4.13 U4.6(1B4)
Unused0_4: P4.12 U4.8(1B5)
Unused0_5: P4.11 U4.9(1B6)
Unused0_6: P4.10 U4.11(1B7)
Unused0_7: P4.9 U4.12(1B8)
Unused0_8: P4.8 U4.13(2B1)
Unused0_9: P4.7 U4.14(2B2)
Unused0_10: P4.6
Unused0_11: P4.5
Unused0_12: P4.4
Unused0_13: P4.3
Unused0_14: P4.2
Unused0_15: P4.1
Unused0_16: P11.2 U8.2(1B1)
Unused0_17: P11.1 U8.3(1B2)
Unused1_0: P10.9
Unused1_1: P10.8 U2.13(2B1)
Unused1_2: P10.7 U2.14(2B2)
Unused1_3: P10.6
Unused1_4: P10.5
Unused1_5: P10.4
Unused1_6: P10.3
Unused1_7: P10.2
Unused1_8: P10.1
Unused1_9: P8.8 U6.2(1B1)
Unused1_10: P8.7 U6.3(1B2)
Unused1_11: P8.6 U6.5(1B3)
Unused1_12: P8.5 U6.6(1B4)
Unused1_13: P8.4 U6.8(1B5)
Unused1_14: P8.3 U6.9(1B6)
Unused1_15: P8.2 U6.11(1B7)
Unused1_16: P8.1 U6.12(1B8)
Unused1_17: P5.5 U6.13(2B1)
Unused1_18: P5.4 U6.14(2B2)
Unused1_19: P5.3 U6.16(2B3)
Unused1_20: P5.2 U6.17(2B4)
Unused1_21: P5.1 U6.19(2B5)
UNUSED2_2: P7.1 U7.22(2B7)
Unused2_3: P7.2 U7.23(2B8)
VSync: U11.17(2B4) ; port VSync
NetD1_1: D1.1(A) R106.2
NetD3_1: D3.1(A) R105.2
NetD6_1: D6.1(A) R113.1
NetR5_2: R5.2 U22.4(PFI)
NetR7_1: R7.1 U3.41(1A5)
NetR8_2: R8.2 U8.25(2OE)
NetR10_2: R10.2 R65.1 U17.1(GND/Adj)
NetR13_2: R13.2 X1.1(OE)
NetR14_1: R14.1 U2.1(1DIR)
NetR15_1: R15.1 U3.1(1DIR)
NetR16_2: R16.2 U4.48(1OE)
NetR17_2: R17.2 U2.48(1OE)
NetR18_2: R18.2 U3.48(1OE)
NetR19_2: R19.2 U4.25(2OE)
NetR20_2: R20.2 U3.25(2OE)
NetR21_2: R21.2 U2.25(2OE)
NetR22_1: R22.1 U5.159(IO/DIFFIO_R5n/INIT_DONE)
NetR23_1: R23.1 U5.25(nCONFIG)
NetR24_1: R24.1 U5.17(nSTATUS)
NetR25_2: R25.2 U5.30(nCE)
NetR26_1: R26.1 U5.153(CONF_DONE)
NetR27_2: R27.2 U5.164(IO/DIFFIO_R4p/CLKUSR)
NetR28_1: R28.1 U6.24(2DIR)
NetR29_1: R29.1 U8.24(2DIR)
NetR30_1: R30.1 U7.24(2DIR)
NetR32_2: R32.2 U6.48(1OE)
NetR33_2: R33.2 U7.48(1OE)
NetR34_2: R34.2 U8.48(1OE)
NetR35_2: R35.2 U11.25(2OE)
NetR36_2: R36.2 U7.25(2OE)
NetR37_2: R37.2 U6.25(2OE)
NetR38_2: R38.2 U9.2(DATA)
NetR39_1: R39.1 U10.24(2DIR)
NetR40_1: R40.1 U10.1(1DIR)
NetR41_1: R41.1 U11.1(1DIR)
NetR42_2: R42.2 U11.48(1OE)
NetR43_2: R43.2 U10.48(1OE)
NetR44_2: R44.2 U11.29(2A6)
NetR45_2: R45.2 U11.24(2DIR)
NetR53_2: R53.2 S1.2 U22.1(GND/Adj)
NetR61_2: R61.2 U16.3(Vin)
NetR62_1: R62.1 R67.2 U16.1(GND/Adj)
NetR63_2: R63.2 U17.3(Vin)
NetR66_1: R66.1 R68.2 U18.1(GND/Adj)
NetR95_2: R95.2 U7.19(2B5)
NetR99_2: R99.2 U7.17(2B4)
NetR117_1: R117.1 U3.40(1A6)
NetR119_1: R119.1 U8.44(1A3)
NetR120_2: R120.2 U8.5(1B3)
NetR121_1: R121.1 U8.43(1A4)
NetR122_2: R122.2 U8.6(1B4)
NetR123_1: R123.1 U8.41(1A5)
NetR124_2: R124.2 U8.8(1B5)
NetR125_1: R125.1 U8.40(1A6)
NetR126_2: R126.2 U8.9(1B6)
NetR127_1: R127.1 U8.38(1A7)
NetR128_2: R128.2 U8.11(1B7)
NetR129_1: R129.1 U8.37(1A8)
NetR130_2: R130.2 U8.12(1B8)
NetR131_2: R131.2 U11.27(2A7)
NetR132_2: R132.2 U11.26(2A8)
NetR133_2: R133.2 U10.25(2OE)

Not connected (* = marked no-connect by the designer): U2 12(1B8) 37(1A8) 38(1A7); U3 8(1B5) 9(1B6); U4 19(2B5) 20(2B6) 22(2B7); U8 13(2B1) 14(2B2) 16(2B3) 17(2B4) 19(2B5) 20(2B6) 22(2B7) 23(2B8); U11 20(2B6) 22(2B7) 23(2B8); U22 5(PFO) 6(WDI) 8(WDO)

## Notes on the sheet
- Reset Circuitry
- JTAG Interface
- Mode Select
- Clock Circuitry
- Serial Configuration Device
- Separate line driver for ADC Control Signals
- 237,238,239,240
- Bypass Capacitors
- EE 52 Digital Oscilloscope Main Components
- 1          4
- Maitreyi Ashok

## Library data of the parts
C2-C91 C111 C118 C124-C128 = Cap: Capacitor; Published: 8-Jun-2000; LatestRevisionDate: 17-Jul-2002; LatestRevisionNote: Re-released for DXP Platform.; PackageReference: RAD-0.3; Publisher: Altium Limited; PackageDescription: Radial Cap, Thru-Hole; 2 Leads; 0.3 in Pin Spacing
C101 C103 C104 C110 C112 C113 = Cap Pol1: Polarized Capacitor (Radial); Published: 8-Jun-2000; LatestRevisionDate: 17-Jul-2002; LatestRevisionNote: Re-released for DXP Platform.; PackageReference: RB7.6-15; Publisher: Altium Limited; PackageDescription: Polarized Capacitor (Radial); 2 Leads
D1 D3 D6 = LED: LED SMT; Published: 8-Jun-2000; LatestRevisionDate: 08-Jul-2005; LatestRevisionNote: Mech Layer 1 removed.; PackageReference: LED-0; Publisher: Altium Limited; PackageDescription: LED; 2 Leads
J1 = CON10
JP1-JP4 = JUMPER3SM
L1 = Inductor: Code_IEC: 1005; Published: 8-Jun-2000; LatestRevisionDate: 29-May-2009; LatestRevisionNote: IPC-7351 Footprint Added.; PackageReference: 0402-A; Publisher: Altium Limited; PackageDescription: Chip Inductor; Code_JEITA: 0402
P1 = MHDR1X4: Header, 4-Pin; LatestRevisionDate: 17-Jul-2002; LatestRevisionNote: Re-released for DXP Platform.; Publisher: Altium Limited
P3 P8 P13 = Header 8: Header, 8-Pin; LatestRevisionDate: 17-Jul-2002; LatestRevisionNote: Re-released for DXP Platform.; Publisher: Altium Limited
P4 P12 = Header 16: Header, 16-Pin; LatestRevisionDate: 17-Jul-2002; LatestRevisionNote: Re-released for DXP Platform.; Publisher: Altium Limited
P5 = Header 5: Header, 5-Pin; LatestRevisionDate: 17-Jul-2002; LatestRevisionNote: Re-released for DXP Platform.; Publisher: Altium Limited
P7 P11 = Header 2: Header, 2-Pin; LatestRevisionDate: 17-Jul-2002; LatestRevisionNote: Re-released for DXP Platform.; Publisher: Altium Limited
P10 P14 = Header 9: Header, 9-Pin; LatestRevisionDate: 17-Jul-2002; LatestRevisionNote: Re-released for DXP Platform.; Publisher: Altium Limited
P15 = Header 3: Header, 3-Pin; LatestRevisionDate: 17-Jul-2002; LatestRevisionNote: Re-released for DXP Platform.; Publisher: Altium Limited
R5-R30 R32-R45 R51-R53 R61-R63 R65-R68 R94-R97 R99 R105 R106 R113 R117-R133 = Res3: Resistor; Published: 8-Jun-2000; LatestRevisionDate: 29-May-2009; LatestRevisionNote: IPC-7351 Footprint Added.; PackageReference: J1-0603; Publisher: Altium Limited; PackageDescription: Chip Resistor
S1 = SW-PB: Switch; Published: 24-Mar-1999; LatestRevisionDate: 17-Jul-2002; LatestRevisionNote: Re-released for DXP Platform.; PackageReference: SPST-2; Publisher: Altium Limited; PackageDescription: Switch; 2 Leads
U2-U4 U6-U8 U10 U11 = 74LVT16245: 16-Bit Bus Transceiver
U5 = EP3C25Q240: Cyclone III EP3C-25 FPGA PQFP240
U9 = EPCS16: Altera Serial Configuration Device
U16-U18 = LM1086: 1.5A Low Dropout Positive Regulator
U22 = MAX705: Maxim uP Supervisory Circuit
X1 = OSCOE: Oscillator with Active High Output Enable